# EasyEDA schematic 1-Schematic_RubikSolver.json
TITLE: ControlBoard; REV: 1.0; Date: 2021-04-03; Sheet: 1/1; Drawn By: pcruiher089; Company: ISDR
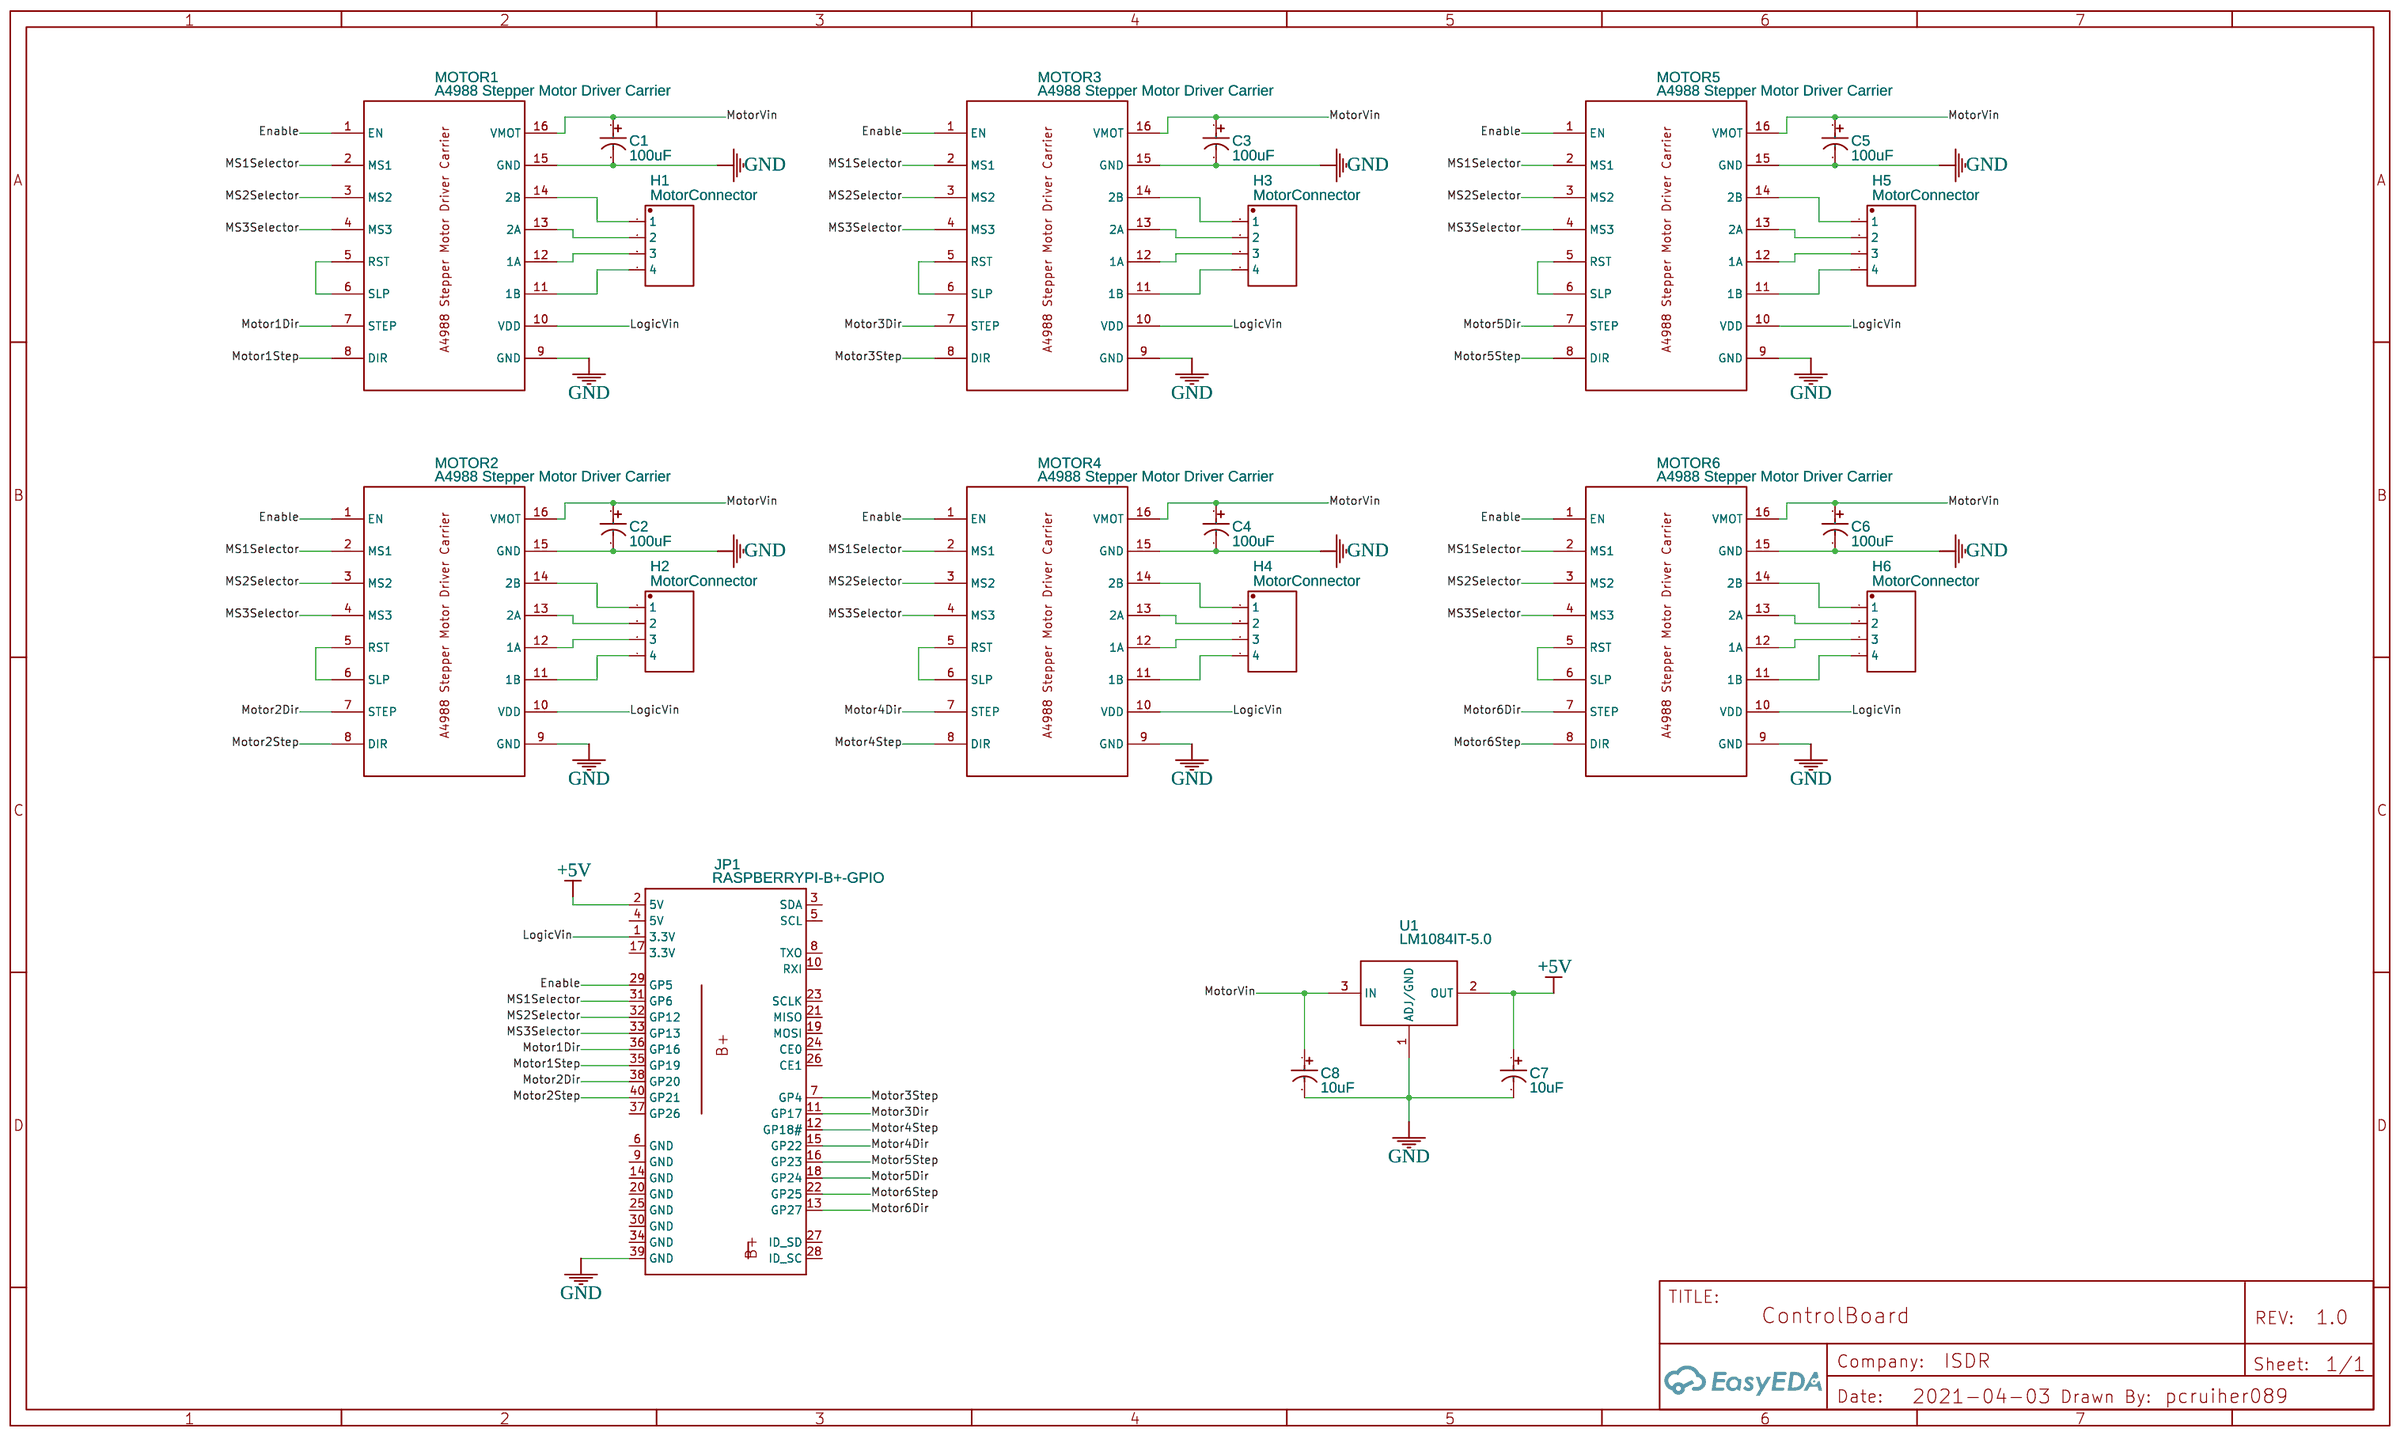
[diagram p0: schematic sheet]

## Parts
C1  100uF  [CAP-TH_BD10.0-P5.00-D1.0-FD]
C2  100uF  [CAP-TH_BD10.0-P5.00-D1.0-FD]
C3  100uF  [CAP-TH_BD10.0-P5.00-D1.0-FD]
C4  100uF  [CAP-TH_BD10.0-P5.00-D1.0-FD]
C5  100uF  [CAP-TH_BD10.0-P5.00-D1.0-FD]
C6  100uF  [CAP-TH_BD10.0-P5.00-D1.0-FD]
C7  10uF  [CAP-TH_BD4.0-P1.50-D0.8-FD]
C8  10uF  [CAP-TH_BD4.0-P1.50-D0.8-FD]
H1  MotorConnector  [HDR-TH_4P-P2.54-V]
H2  MotorConnector  [HDR-TH_4P-P2.54-V]
H3  MotorConnector  [HDR-TH_4P-P2.54-V]
H4  MotorConnector  [HDR-TH_4P-P2.54-V]
H5  MotorConnector  [HDR-TH_4P-P2.54-V]
H6  MotorConnector  [HDR-TH_4P-P2.54-V]
JP1  RASPBERRYPI-B+-GPIO  [2X20-SHROUDED]
MOTOR1  A4988 Stepper Motor Driver Carrier  [A4988 STEPPER MOTOR DRIVER CARRIER]
MOTOR2  A4988 Stepper Motor Driver Carrier  [A4988 STEPPER MOTOR DRIVER CARRIER]
MOTOR3  A4988 Stepper Motor Driver Carrier  [A4988 STEPPER MOTOR DRIVER CARRIER]
MOTOR4  A4988 Stepper Motor Driver Carrier  [A4988 STEPPER MOTOR DRIVER CARRIER]
MOTOR5  A4988 Stepper Motor Driver Carrier  [A4988 STEPPER MOTOR DRIVER CARRIER]
MOTOR6  A4988 Stepper Motor Driver Carrier  [A4988 STEPPER MOTOR DRIVER CARRIER]
U1  LM1084IT-5.0  [TO-220-3_L10.0-W4.5-P2.54-L]

## Library data of the parts
C1-C6 = 100uF 100V: Supplier: LCSC; Manufacturer: ValuePro; Supplier Part: C36472; LCSC Assembly: Yes; SMT Type: Extend; Paste Type: expand
C7 C8 = 10uF 25V 4*5: Supplier: LCSC; Manufacturer: ValuePro; Supplier Part: C43846
H1-H6 = Header-Male-2.54_1x4: Supplier: LCSC; Manufacturer: Ckmtw; Manufacturer Part: 210S-1*4P L=11.6MMGold-plated black; Contributor: LCSC; Supplier Part: C124378; LCSC Assembly: Yes; SMT Type: Extend; Paste Type: expand
JP1 = RASPBERRYPI-B+-GPIO: Raspberry Pi B+ GPIO Header; Contributor: SparkFun
MOTOR1-MOTOR6 = A4988 Stepper Motor Driver Carrier: Contributor: winter2015; sourceId: YsmgyP7pj
U1 = LM1084IT-5.0: Supplier: LCSC; Manufacturer: TI; image: //image.lceda.cn/szlcsc/C9719.jpg; Supplier Part: C9719; LCSC Assembly: Yes; SMT Type: Extend; Paste Type: expand

## Nets
+5V: C7.1 JP1.2(5V) U1.2(OUT)
GND: C1.2 C2.2 C3.2 C4.2 C5.2 C6.2 C7.2 C8.2 JP1.39(GND) MOTOR1.9(GND) MOTOR1.15(GND) MOTOR2.9(GND) MOTOR2.15(GND) MOTOR3.9(GND) MOTOR3.15(GND) MOTOR4.9(GND) MOTOR4.15(GND) MOTOR5.9(GND) MOTOR5.15(GND) MOTOR6.9(GND) MOTOR6.15(GND) U1.1(ADJ/GND)
Enable: JP1.29(GP5) MOTOR1.1(EN) MOTOR2.1(EN) MOTOR3.1(EN) MOTOR4.1(EN) MOTOR5.1(EN) MOTOR6.1(EN)
LogicVin: JP1.1(3.3V) MOTOR1.10(VDD) MOTOR2.10(VDD) MOTOR3.10(VDD) MOTOR4.10(VDD) MOTOR5.10(VDD) MOTOR6.10(VDD)
Motor1Dir: JP1.36(GP16) MOTOR1.7(STEP)
Motor1Step: JP1.35(GP19) MOTOR1.8(DIR)
Motor2Dir: JP1.38(GP20) MOTOR2.7(STEP)
Motor2Step: JP1.40(GP21) MOTOR2.8(DIR)
Motor3Dir: JP1.11(GP17) MOTOR3.7(STEP)
Motor3Step: JP1.7(GP4) MOTOR3.8(DIR)
Motor4Dir: JP1.15(GP22) MOTOR4.7(STEP)
Motor4Step: JP1.12(GP18#) MOTOR4.8(DIR)
Motor5Dir: JP1.18(GP24) MOTOR5.7(STEP)
Motor5Step: JP1.16(GP23) MOTOR5.8(DIR)
Motor6Dir: JP1.13(GP27) MOTOR6.7(STEP)
Motor6Step: JP1.22(GP25) MOTOR6.8(DIR)
MotorVin: C1.1 C2.1 C3.1 C4.1 C5.1 C6.1 C8.1 MOTOR1.16(VMOT) MOTOR2.16(VMOT) MOTOR3.16(VMOT) MOTOR4.16(VMOT) MOTOR5.16(VMOT) MOTOR6.16(VMOT) U1.3(IN)
MS1Selector: JP1.31(GP6) MOTOR1.2(MS1) MOTOR2.2(MS1) MOTOR3.2(MS1) MOTOR4.2(MS1) MOTOR5.2(MS1) MOTOR6.2(MS1)
MS2Selector: JP1.32(GP12) MOTOR1.3(MS2) MOTOR2.3(MS2) MOTOR3.3(MS2) MOTOR4.3(MS2) MOTOR5.3(MS2) MOTOR6.3(MS2)
MS3Selector: JP1.33(GP13) MOTOR1.4(MS3) MOTOR2.4(MS3) MOTOR3.4(MS3) MOTOR4.4(MS3) MOTOR5.4(MS3) MOTOR6.4(MS3)
Net-(H1-1): H1.1 MOTOR1.14(2B)
Net-(H1-2): H1.2 MOTOR1.13(2A)
Net-(H1-3): H1.3 MOTOR1.12(1A)
Net-(H1-4): H1.4 MOTOR1.11(1B)
Net-(H2-1): H2.1 MOTOR2.14(2B)
Net-(H2-2): H2.2 MOTOR2.13(2A)
Net-(H2-3): H2.3 MOTOR2.12(1A)
Net-(H2-4): H2.4 MOTOR2.11(1B)
Net-(H3-1): H3.1 MOTOR3.14(2B)
Net-(H3-2): H3.2 MOTOR3.13(2A)
Net-(H3-3): H3.3 MOTOR3.12(1A)
Net-(H3-4): H3.4 MOTOR3.11(1B)
Net-(H4-1): H4.1 MOTOR4.14(2B)
Net-(H4-2): H4.2 MOTOR4.13(2A)
Net-(H4-3): H4.3 MOTOR4.12(1A)
Net-(H4-4): H4.4 MOTOR4.11(1B)
Net-(H5-1): H5.1 MOTOR5.14(2B)
Net-(H5-2): H5.2 MOTOR5.13(2A)
Net-(H5-3): H5.3 MOTOR5.12(1A)
Net-(H5-4): H5.4 MOTOR5.11(1B)
Net-(H6-1): H6.1 MOTOR6.14(2B)
Net-(H6-2): H6.2 MOTOR6.13(2A)
Net-(H6-3): H6.3 MOTOR6.12(1A)
Net-(H6-4): H6.4 MOTOR6.11(1B)
Net-(MOTOR1-5): MOTOR1.5(RST) MOTOR1.6(SLP)
Net-(MOTOR2-5): MOTOR2.5(RST) MOTOR2.6(SLP)
Net-(MOTOR3-5): MOTOR3.5(RST) MOTOR3.6(SLP)
Net-(MOTOR4-5): MOTOR4.5(RST) MOTOR4.6(SLP)
Net-(MOTOR5-5): MOTOR5.5(RST) MOTOR5.6(SLP)
Net-(MOTOR6-5): MOTOR6.5(RST) MOTOR6.6(SLP)

Not connected (* = marked no-connect by the designer): JP1 3(SDA) 4(5V) 5(SCL) 6(GND) 8(TXO) 9(GND) 10(RXI) 14(GND) 17(3.3V) 19(MOSI) 20(GND) 21(MISO) 23(SCLK) 24(CE0) 25(GND) 26(CE1) 27(ID_SD) 28(ID_SC) 30(GND) 34(GND) 37(GP26)
